# Altium schematic sheet PowerSupply.SchDoc: <?>
size 420 x 297 mm; ApprovedBy: <?>; CheckedBy: <?>; CompanyName: ISON IMPORT-EXPORT COMPANY LIMITED; DrawnBy: <?>; DocumentNumber: <?>; Revision: <?>; SheetNumber: <?>; SheetTotal: <?>; Size: A3; ISON_Model: <?>
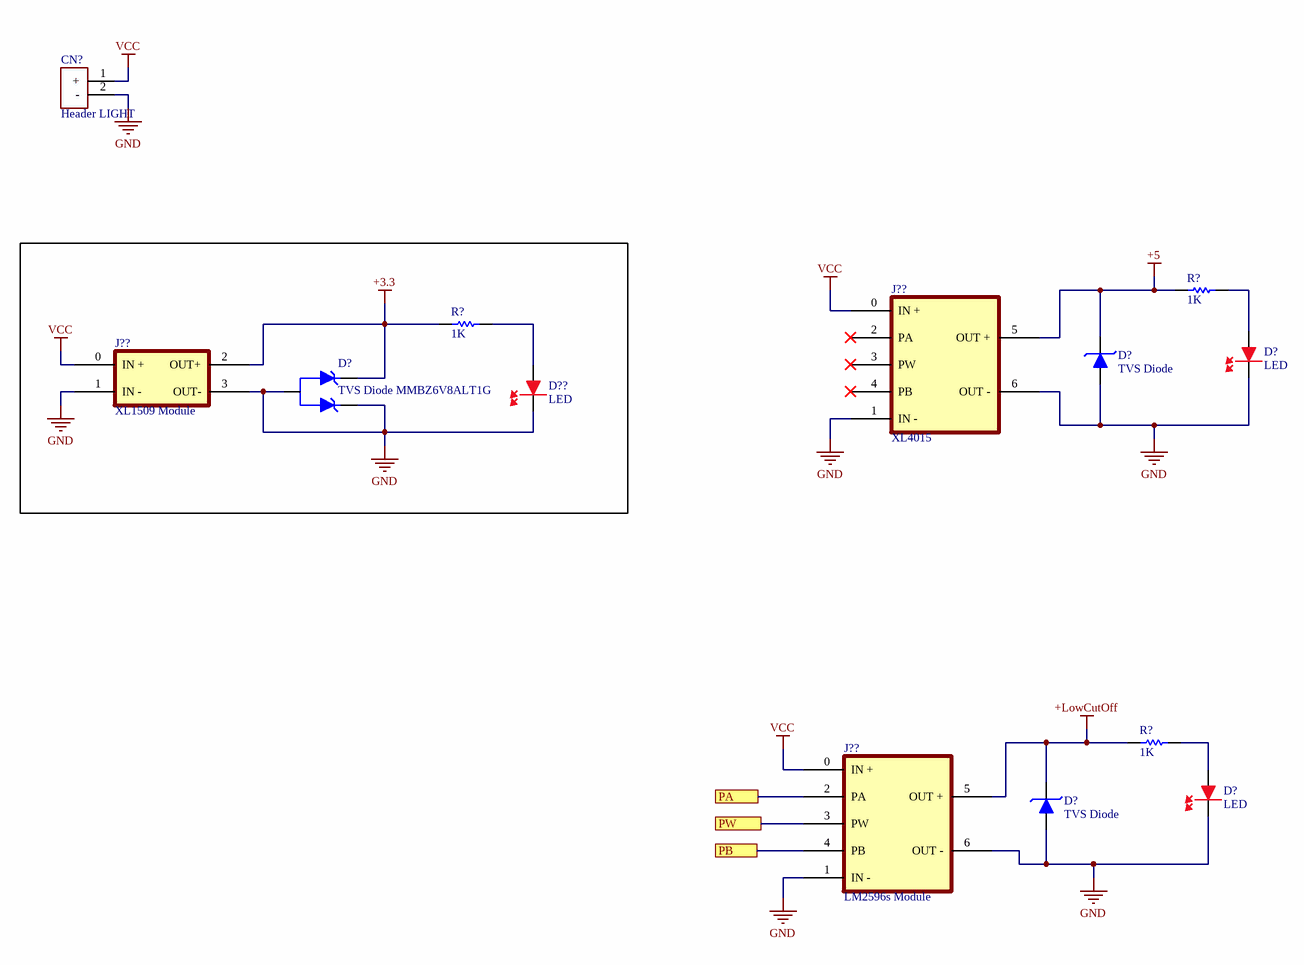
[diagram p0: PowerSupply.SchDoc]

## Parts
(Parts that share a designator on the sheet are numbered #1, #2 ... from top to bottom, then left to right.)
CN?  Header LIGHT  [HEADER 2 PIN MOLEX POLE]
D?#1  TVS Diode  [SOD-128]
D?#2  LED  [0805 LED]
D?#3  TVS Diode MMBZ6V8ALT1G  [SOT95P237X111-3N]
D?#4  LED  [0805 LED]
D?#5  TVS Diode  [SOD-128]
D??  LED  [0805 LED]
J??#1  XL4015  [XL4015 Module]
J??#2  XL1509 Module  [XL1509 MODULE]
J??#3  LM2596s Module  [LM2596s MODULE]
R?#1  1K  [0805 Modificado]
R?#2  1K  [0805 Modificado]
R?#3  1K  [0805 Modificado]

## Ports
PA, PB, PW

## Nets
+3.3: D?#3.2(K2) J??#2.2(OUT+) R?#2.2
+5: D?#1.2(K) J??#1.5(OUT_+) R?#1.2
+LowCutOff: D?#5.2(K) J??#3.5(OUT_+) R?#3.2
GND: CN?.2(-) D?#1.1(A) D?#2.1(K) D?#3.1(K1) D?#3.3(A) D?#4.1(K) D?#5.1(A) D??.1(K) J??#1.1(IN_-) J??#1.6(OUT_-) J??#2.1(IN_-) J??#2.3(OUT-) J??#3.1(IN_-) J??#3.6(OUT_-)
VCC: CN?.1(+) J??#1.0(IN_+) J??#2.0(IN_+) J??#3.0(IN_+)
PA: J??#3.2(PA) ; port PA
PB: J??#3.4(PB) ; port PB
PW: J??#3.3(PW) ; port PW
NetD?#2_2: D?#2.2(A) R?#1.1
NetD?#4_2: D?#4.2(A) R?#3.1
NetD??_2: D??.2(A) R?#2.1

Not connected (* = marked no-connect by the designer): J??#1 2(PA)* 3(PW)* 4(PB)*

## Notes on the sheet
- Modify 1:
- DWG No:
- Model:
- SHEET:
- Modify 2:
- ORIGINAL:
- Revision:
- Date:
- Draw By:
- Size:
- File:
- Approve By:
- TOTAL:
- Modify 3:

## Library data of the parts
CN? = CON Header LIGHT Pole: Connector 3.96MM 02 PIN WAFER STRAIGHTPIN (MALE)
D?#1 = TVS Diode VS24VUA1LAMTR: TVS Diode VS24VUA1LAMTR . Breakdown Voltage = 28.1 V , Clamping Voltage 38.9 V , Working Reverse Standoff Voltage 24V; Published: 8-Jun-2000; LatestRevisionDate: 17-Jul-2002; LatestRevisionNote: Re-released for DXP Platform.; DatasheetVersion: 1998; PackageVersion: Aug-1999; PackageReference: DO-41; Publisher: Altium Limited; PackageDescription: Diode, Axial; Body 5.2 x 2.7 mm (LxDia. max), Lead Dia. 0.86 mm (max); Code_JEDEC: DO-204-AL; ComponentLink1Description: Manufacturer Link; ComponentLink1URL: http://www.fairchildsemi.com/; ComponentLink2Description: Datasheet; ComponentLink2URL: http://www.fairchildsemi.com/ds/1N%2F1N4001.pdf
D?#2 D?#4 D?? = LED RED (SMD): LED SMD  mcd,Red Color Red Diffused Lens
D?#3 = TVS Diode MMBZ6V8ALT1G: 46V Clamp 870mA Ipp Tvs Diode Surface Mount SOT-23-3 (TO-236); Package: None; Price: None; Value: *; MP: MMBZ6V8ALT1G; Availability: Unavailable
D?#5 = TVS Diode VS6V0UA1LAMTR: TVS Diode VS6V0UA1LAMTR . Breakdown Voltage = 6.795V , Clamping Voltage 10.5 V , Working Reverse Standoff Voltage 5V; Published: 8-Jun-2000; LatestRevisionDate: 17-Jul-2002; LatestRevisionNote: Re-released for DXP Platform.; DatasheetVersion: 1998; PackageVersion: Aug-1999; PackageReference: DO-41; Publisher: Altium Limited; PackageDescription: Diode, Axial; Body 5.2 x 2.7 mm (LxDia. max), Lead Dia. 0.86 mm (max); Code_JEDEC: DO-204-AL; ComponentLink1Description: Manufacturer Link; ComponentLink1URL: http://www.fairchildsemi.com/; ComponentLink2Description: Datasheet; ComponentLink2URL: http://www.fairchildsemi.com/ds/1N%2F1N4001.pdf
J??#1 = Buck XL4015 Module 5A: XL4015 Module step down converter
J??#2 = Buck XL1509 Module: XL1509 Module step down converter
J??#3 = Buck LM2596s Module 5A: LM2596s Module step down converter
R?#1-R?#3 = Resistor 0805 SMD 1K OHM +/- 1% (CHIP): 'RES SMD 1K OHM 1% 1/8W 0805/0805W8F1001T5E